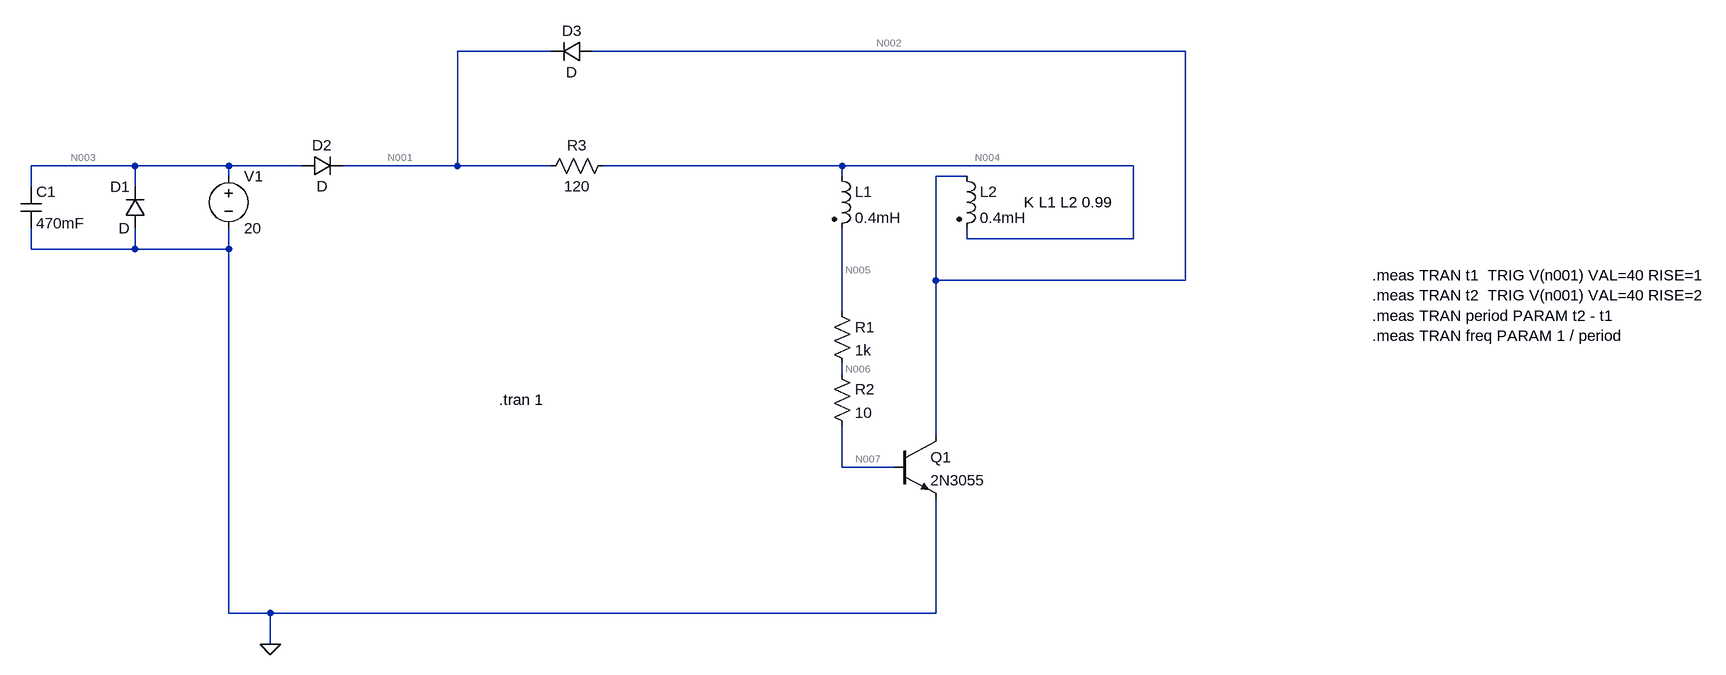
[diagram p0: schematic Simulation.asc]
Simulation.asc, the LTspice schematic file:
Version 4
SHEET 1 2256 724
WIRE 448 -208 304 -208
WIRE 1424 -208 512 -208
WIRE -192 -32 -352 -32
WIRE -48 -32 -192 -32
WIRE 64 -32 -48 -32
WIRE 304 -32 304 -208
WIRE 304 -32 128 -32
WIRE 448 -32 304 -32
WIRE 896 -32 528 -32
WIRE 1344 -32 896 -32
WIRE -48 -16 -48 -32
WIRE 896 -16 896 -32
WIRE 1088 -16 1040 -16
WIRE -352 0 -352 -32
WIRE -192 0 -192 -32
WIRE 1088 80 1088 64
WIRE 1344 80 1344 -32
WIRE 1344 80 1088 80
WIRE -352 96 -352 64
WIRE -192 96 -192 64
WIRE -192 96 -352 96
WIRE -48 96 -48 64
WIRE -48 96 -192 96
WIRE 1040 144 1040 -16
WIRE 1424 144 1424 -208
WIRE 1424 144 1040 144
WIRE 896 192 896 64
WIRE 896 288 896 272
WIRE 1040 384 1040 144
WIRE 896 432 896 368
WIRE 976 432 896 432
WIRE -48 656 -48 96
WIRE 16 656 -48 656
WIRE 1040 656 1040 480
WIRE 1040 656 16 656
WIRE 16 704 16 656
FLAG 16 704 0
SYMBOL res 880 176 R0
SYMATTR InstName R1
SYMATTR Value 1k
SYMBOL res 880 272 R0
SYMATTR InstName R2
SYMATTR Value 10
SYMBOL ind2 880 -32 R0
SYMATTR InstName L1
SYMATTR Value 0.4mH
SYMATTR Type ind
SYMBOL voltage -48 -32 R0
WINDOW 123 0 0 Left 0
WINDOW 39 0 0 Left 0
SYMATTR InstName V1
SYMATTR Value 20
SYMBOL diode -176 64 R180
WINDOW 0 24 64 Left 2
WINDOW 3 24 0 Left 2
SYMATTR InstName D1
SYMBOL diode 64 -16 R270
WINDOW 0 32 32 VTop 2
WINDOW 3 0 32 VBottom 2
SYMATTR InstName D2
SYMBOL npn 976 384 R0
SYMATTR InstName Q1
SYMATTR Value 2N3055
SYMBOL diode 512 -224 R90
WINDOW 0 0 32 VBottom 2
WINDOW 3 32 32 VTop 2
SYMATTR InstName D3
SYMBOL cap -368 0 R0
SYMATTR InstName C1
SYMATTR Value 470mF
SYMBOL ind2 1072 -32 R0
SYMATTR InstName L2
SYMATTR Value 0.4mH
SYMATTR Type ind
SYMBOL res 544 -48 R90
WINDOW 0 0 56 VBottom 2
WINDOW 3 32 56 VTop 2
SYMATTR InstName R3
SYMATTR Value 120
TEXT 1176 24 Left 2 !K L1 L2 0.99
TEXT 368 328 Left 2 !.tran 1
TEXT 1712 136 Left 2 !.meas TRAN t1  TRIG V(n001) VAL=40 RISE=1\n.meas TRAN t2  TRIG V(n001) VAL=40 RISE=2\n.meas TRAN period PARAM t2 - t1\n.meas TRAN freq PARAM 1 / period

The netlist it stands for:
* Simulation.asc
R1 N005 N006 1k
R2 N006 N007 10
L1 N004 N005 0.4mH
V1 N003 0 20
D1 0 N003 D
D2 N003 N001 D
Q1 N002 N007 0 0 2N3055
D3 N002 N001 D
C1 N003 0 470mF
L2 N002 N004 0.4mH
R3 N004 N001 120
.model D D
.lib standard.dio
.model NPN NPN
.model PNP PNP
.lib standard.bjt
K L1 L2 0.99
.tran 1
.meas TRAN t1  TRIG V(n001) VAL=40 RISE=1
.meas TRAN t2  TRIG V(n001) VAL=40 RISE=2
.meas TRAN period PARAM t2 - t1
.meas TRAN freq PARAM 1 / period
.backanno
.end

* Results of the author's LTspice run, read from the files saved beside the schematic
* Operating Point, zero values left out:
*   V(n005) = 2.558 V
*   V(n006) = 429.1 mV
*   V(n007) = 407.8 mV
*   V(n004) = 2.558 V
*   V(n003) = 20 V
*   V(n001) = 19.22 V
*   V(n002) = 2.558 V
*   Ic(Q1) = 136.7 mA
*   Ib(Q1) = 2.129 mA
*   Ie(Q1) = -138.8 mA
*   I(C1) = 9.4 pA
*   I(D3) = -16.67 pA
*   I(D2) = 138.8 mA
*   I(D1) = -20.01 pA
*   I(L2) = -136.7 mA
*   I(L1) = 2.129 mA
*   I(R3) = -138.8 mA
*   I(R2) = 2.129 mA
*   I(R1) = 2.129 mA
*   I(V1) = -138.8 mA
* From the log:
*   Measurement "t1" FAIL'ed
*   Measurement "t2" FAIL'ed
*   Measurement "period" FAIL'ed
*   Measurement "freq" FAIL'ed